# EAGLE design Calc V4 Final (EAGLE 6.3)
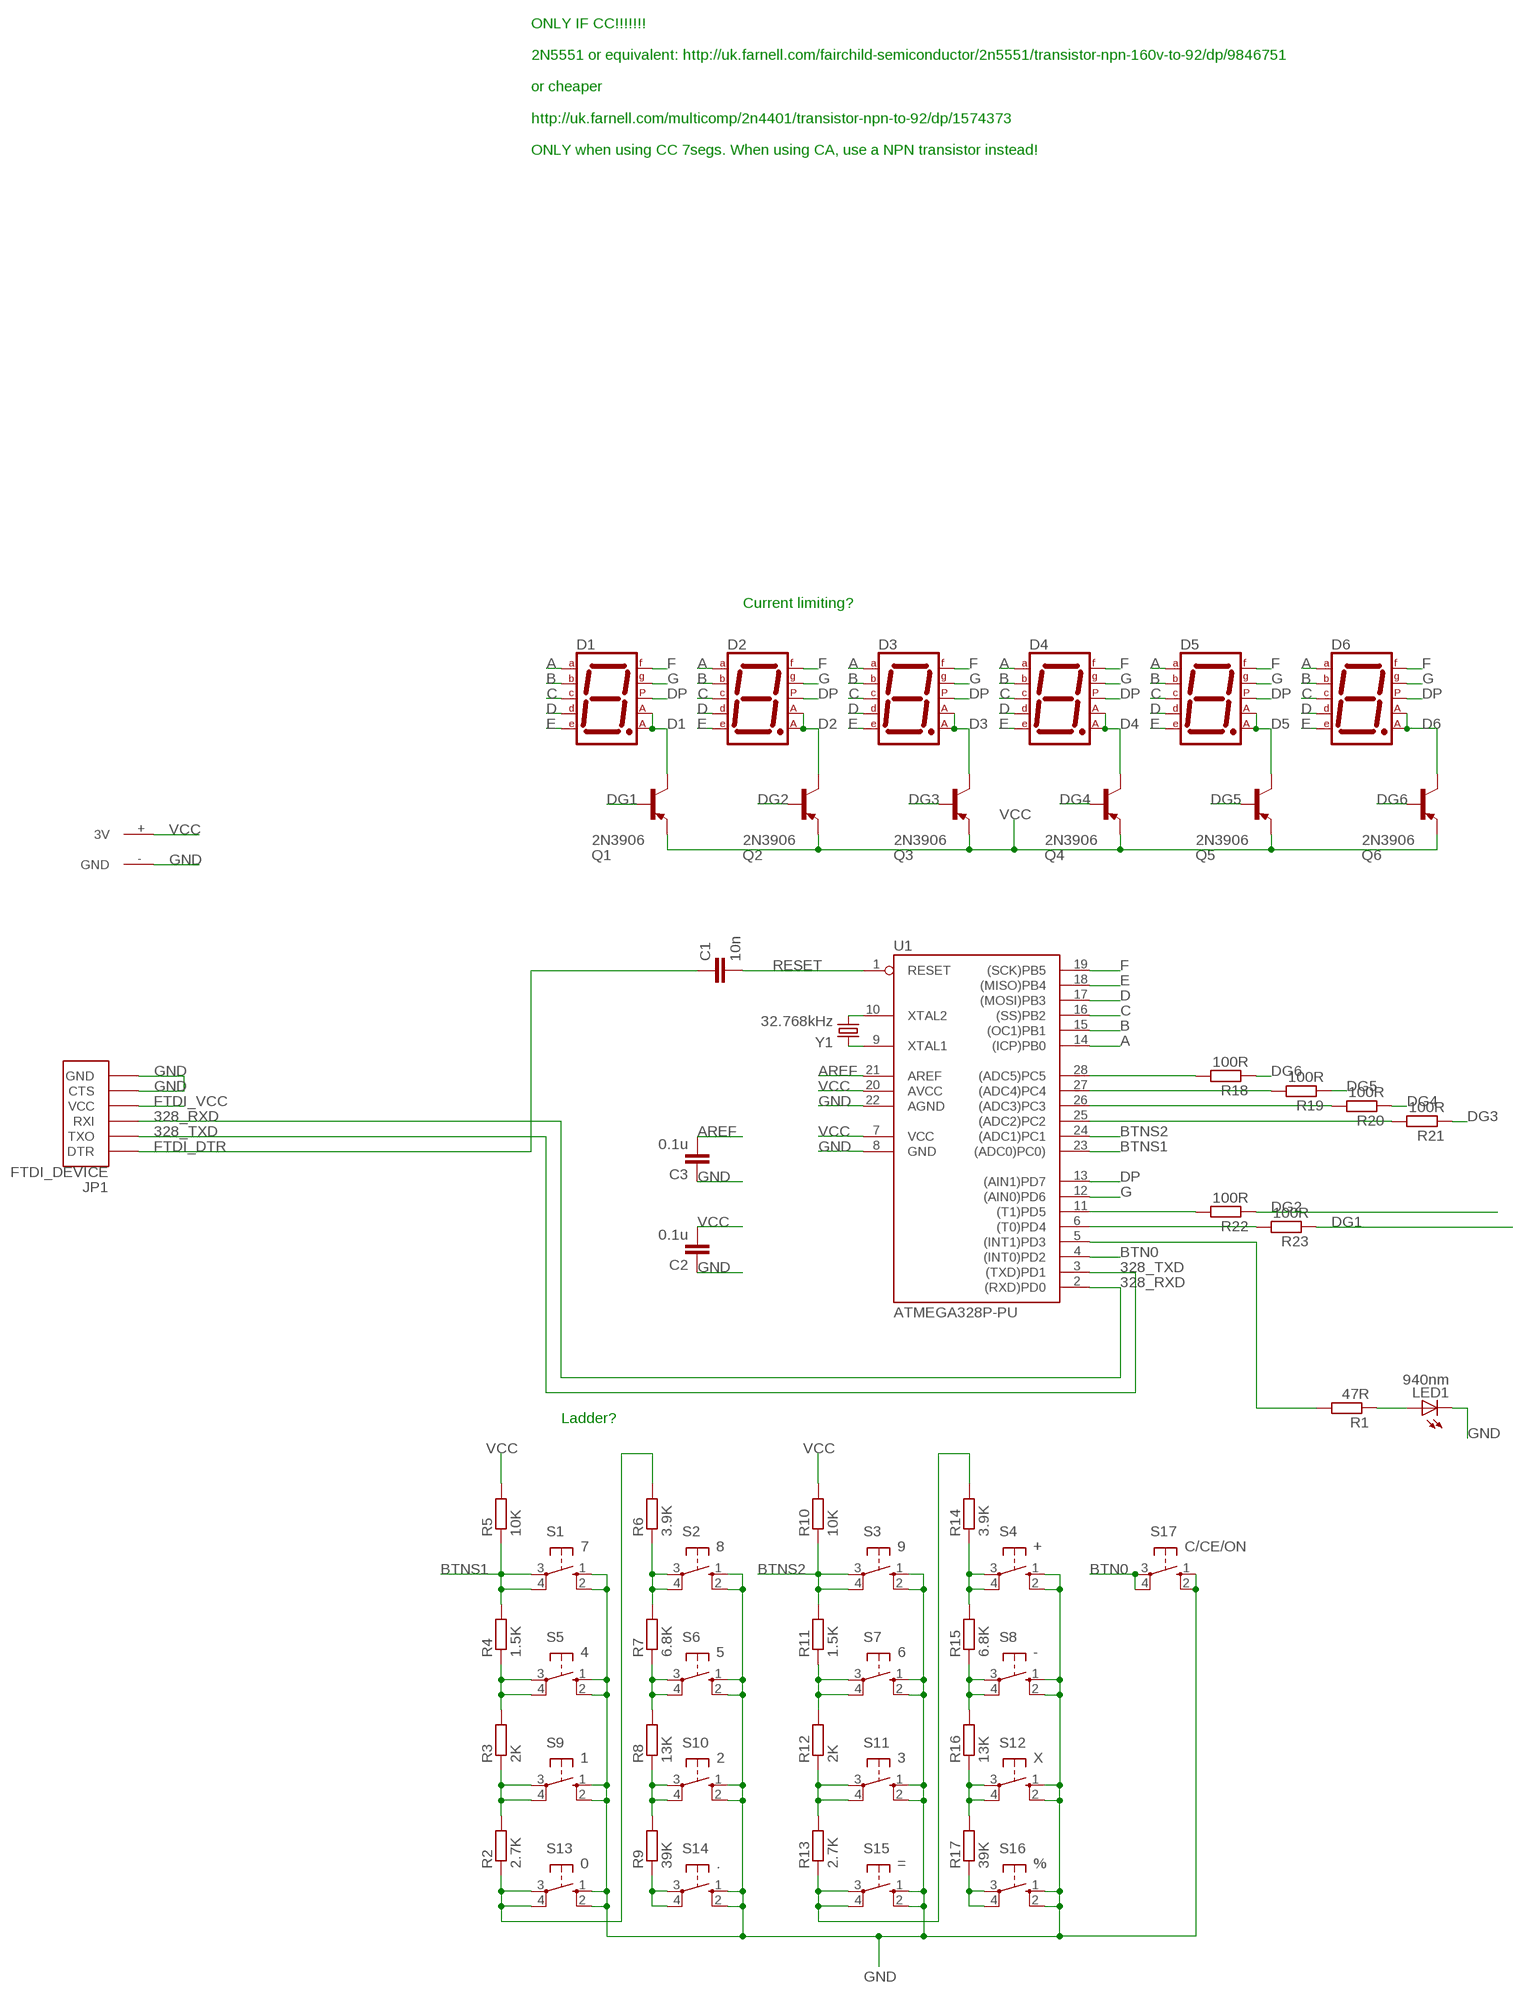
[diagram p0: schematic, sheet 1]

## Parts
C1  10n  C-EU025-024X044  [C025-024X044]
C2  0.1u  C-EU025-024X044  [C025-024X044]
C3  0.1u  C-EU025-024X044  [C025-024X044]
D1  7SEG-MCA  [7SEG-7]
D2  7SEG-MCA  [7SEG-7]
D3  7SEG-MCA  [7SEG-7]
D4  7SEG-MCA  [7SEG-7]
D5  7SEG-MCA  [7SEG-7]
D6  7SEG-MCA  [7SEG-7]
JP1  FTDI_DEVICE  [FTDI_DEVICE_SIDE]
LED1  940nm  LED5MM  [LED5MM]
Q1  2N3906  [TO92]
Q2  2N3906  [TO92]
Q3  2N3906  [TO92]
Q4  2N3906  [TO92]
Q5  2N3906  [TO92]
Q6  2N3906  [TO92]
R1  47R  R-EU_0207/10  [0207/10]
R2  2.7K  R-EU_0207/10  [0207/10]
R3  2K  R-EU_0207/10  [0207/10]
R4  1.5K  R-EU_0207/10  [0207/10]
R5  10K  R-EU_0207/10  [0207/10]
R6  3.9K  R-EU_0207/10  [0207/10]
R7  6.8K  R-EU_0207/10  [0207/10]
R8  13K  R-EU_0207/10  [0207/10]
R9  39K  R-EU_0207/10  [0207/10]
R10  10K  R-EU_0207/10  [0207/10]
R11  1.5K  R-EU_0207/10  [0207/10]
R12  2K  R-EU_0207/10  [0207/10]
R13  2.7K  R-EU_0207/10  [0207/10]
R14  3.9K  R-EU_0207/10  [0207/10]
R15  6.8K  R-EU_0207/10  [0207/10]
R16  13K  R-EU_0207/10  [0207/10]
R17  39K  R-EU_0207/10  [0207/10]
R18  100R  R-EU_0207/7  [0207/7]
R19  100R  R-EU_0207/7  [0207/7]
R20  100R  R-EU_0207/7  [0207/7]
R21  100R  R-EU_0207/7  [0207/7]
R22  100R  R-EU_0207/7  [0207/7]
R23  100R  R-EU_0207/7  [0207/7]
S1  7  10-XX  [B3F-10XX]
S2  8  10-XX  [B3F-10XX]
S3  9  10-XX  [B3F-10XX]
S4  +  10-XX  [B3F-10XX]
S5  4  10-XX  [B3F-10XX]
S6  5  10-XX  [B3F-10XX]
S7  6  10-XX  [B3F-10XX]
S8  -  10-XX  [B3F-10XX]
S9  1  10-XX  [B3F-10XX]
S10  2  10-XX  [B3F-10XX]
S11  3  10-XX  [B3F-10XX]
S12  X  10-XX  [B3F-10XX]
S13  0  10-XX  [B3F-10XX]
S14  .  10-XX  [B3F-10XX]
S15  =  10-XX  [B3F-10XX]
S16  %  10-XX  [B3F-10XX]
S17  C/CE/ON  10-XX  [B3F-10XX]
U1  ATMEGA328P-PU  [DIL28-3]
U$1  AAA-BATTERY  [AAA-BATTERY-CONTACT]
Y1  32.768kHz  CRYSTALTC26H_EZ  [TC26HEZ]

## Nets
328_RXD: JP1.P$3(RXI) U1.2((RXD)PD0)
328_TXD: JP1.P$2(TXO) U1.3((TXD)PD1)
A: D1.10(A) D2.10(A) D3.10(A) D4.10(A) D5.10(A) D6.10(A) U1.14((ICP)PB0)
AREF: C3.2 U1.21(AREF)
B: D1.9(B) D2.9(B) D3.9(B) D4.9(B) D5.9(B) D6.9(B) U1.15((OC1)PB1)
BTN0: S17.3(P) S17.4(P1) U1.4((INT0)PD2)
BTNS1: R4.2 R5.1 S1.3(P) S1.4(P1) U1.23((ADC0)PC0))
BTNS2: R10.1 R11.2 S3.3(P) S3.4(P1) U1.24((ADC1)PC1)
C: D1.8(C) D2.8(C) D3.8(C) D4.8(C) D5.8(C) D6.8(C) U1.16((SS)PB2)
D: D1.5(D) D2.5(D) D3.5(D) D4.5(D) D5.5(D) D6.5(D) U1.17((MOSI)PB3)
D1: D1.1(CA1) D1.6(CA2) Q1.1(C)
D2: D2.1(CA1) D2.6(CA2) Q2.1(C)
D3: D3.1(CA1) D3.6(CA2) Q3.1(C)
D4: D4.1(CA1) D4.6(CA2) Q4.1(C)
D5: D5.1(CA1) D5.6(CA2) Q5.1(C)
D6: D6.1(CA1) D6.6(CA2) Q6.1(C)
DG1: Q1.2(B) R23.1
DG2: Q2.2(B) R22.1
DG3: Q3.2(B) R21.1
DG4: Q4.2(B) R20.1
DG5: Q5.2(B) R19.1
DG6: Q6.2(B) R18.1
DP: D1.7(DP) D2.7(DP) D3.7(DP) D4.7(DP) D5.7(DP) D6.7(DP) U1.13((AIN1)PD7)
E: D1.4(E) D2.4(E) D3.4(E) D4.4(E) D5.4(E) D6.4(E) U1.18((MISO)PB4)
F: D1.2(F) D2.2(F) D3.2(F) D4.2(F) D5.2(F) D6.2(F) U1.19((SCK)PB5)
FTDI_DTR: C1.1 JP1.P$1(DTR)
FTDI_VCC: JP1.P$4(VCC)
G: D1.3(G) D2.3(G) D3.3(G) D4.3(G) D5.3(G) D6.3(G) U1.12((AIN0)PD6)
GND: C2.1 C3.1 JP1.P$5(CTS) JP1.P$6(GND) LED1.K(C) S1.1(S) S1.2(S1) S2.1(S) S2.2(S1) S3.1(S) S3.2(S1) S4.1(S) S4.2(S1) S5.1(S) S5.2(S1) S6.1(S) S6.2(S1) S7.1(S) S7.2(S1) S8.1(S) S8.2(S1) S9.1(S) S9.2(S1) S10.1(S) S10.2(S1) S11.1(S) S11.2(S1) S12.1(S) S12.2(S1) S13.1(S) S13.2(S1) S14.1(S) S14.2(S1) S15.1(S) S15.2(S1) S16.1(S) S16.2(S1) S17.1(S) S17.2(S1) U1.8(GND) U1.22(AGND) U$1.-(GND)
N$1: LED1.A R1.1
N$2: R1.2 U1.5((INT1)PD3)
N$4: R2.1 R6.2 S13.3(P) S13.4(P1)
N$5: R2.2 R3.1 S9.3(P) S9.4(P1)
N$6: R3.2 R4.1 S5.3(P) S5.4(P1)
N$7: R6.1 R7.2 S2.3(P) S2.4(P1)
N$9: R9.1 S14.3(P) S14.4(P1)
N$10: R8.1 R9.2 S10.3(P) S10.4(P1)
N$11: R7.1 R8.2 S6.3(P) S6.4(P1)
N$12: R18.2 U1.28((ADC5)PC5)
N$13: R11.1 R12.2 S7.3(P) S7.4(P1)
N$14: R13.1 R14.2 S15.3(P) S15.4(P1)
N$15: R12.1 R13.2 S11.3(P) S11.4(P1)
N$16: R17.1 S16.3(P) S16.4(P1)
N$17: R16.1 R17.2 S12.3(P) S12.4(P1)
N$18: R15.1 R16.2 S8.3(P) S8.4(P1)
N$19: R14.1 R15.2 S4.3(P) S4.4(P1)
N$20: R19.2 U1.27((ADC4)PC4)
N$21: R20.2 U1.26((ADC3)PC3)
N$22: R21.2 U1.25((ADC2)PC2)
N$23: R22.2 U1.11((T1)PD5)
N$24: R23.2 U1.6((T0)PD4)
RESET: C1.2 U1.1(RESET)
VCC [vcc]: C2.2 Q1.3(E) Q2.3(E) Q3.3(E) Q4.3(E) Q5.3(E) Q6.3(E) R5.2 R10.2 U1.7(VCC) U1.20(AVCC) U$1.+(3V)
XTAL_N: U1.9(XTAL1) Y1.2
XTAL_P: U1.10(XTAL2) Y1.1

## Notes on the sheet
- ONLY IF CC!!!!!!!
  
  2N5551 or equivalent: http://uk.farnell.com/fairchild-semiconductor/2n5551/transistor-npn-160v-to-92/dp/9846751
  
  or cheaper
  
  http://uk.farnell.com/multicomp/2n4401/transistor-npn-to-92/dp/1574373
  
  ONLY when using CC 7segs. When using CA, use a NPN transistor instead!
- Current limiting?
- Ladder?

## Library data of the parts
C1-C3 = rcl:C-EU: CAPACITOR, European symbol
D1-D6 = segment:7SEG-MCA: 7-segment DISPLAY single anode, 13 mm
JP1 = SparkFun-Connectors:FTDI_DEVICE: Connector which mates to FTDI basic or FTDI cable.
LED1 = ledtidy:LED: LED OSRAM: - CHIPLED LG R971, LG N971, LY N971, LG Q971, LY Q971, LO R971, LY R971 LH N974, LH R974 LS Q976, LO Q976, LY Q976 LO Q996 - Hyper CHIPLED LW Q18S LB Q993, LB Q99A, LB R99A - SideLED LS A670, LO A670, LY A670, LG A670, LP A670 LB A673, LV A673, LT A673, LW A673 LH A674 LY A675 LS A676, LA A676, LO A676, LY A676, LW A676 LS A679, LY A679, LG A679 - Hyper Micro SIDELED® LS Y876, LA Y876, LO Y876, LY Y876 LT Y87S - SmartLED LW L88C, LW L88S LB L89C, LB L89S, LG L890 LS L89K, LO L89K, LY L89K LS L896, LA L896, LO L896, LY L896 - TOPLED LS T670, LO T670, LY T670, LG T670, LP T670 LSG T670, LSP T670, LSY T670, LOP T670, LYG T670 LG T671, LOG T671, LSG T671 LB T673, LV T673, LT T673, LW T673 LH T674 LS T676, LA T676, LO T676, LY T676, LB T676, LH T676, LSB T676, LW T676 LB T67C, LV T67C, LT T67C, LS T67K, LO T67K, LY T67K, LW E67C LS E67B, LA E67B, LO E67B, LY E67B, LB E67C, LV E67C, LT E67C LW T67C LS T679, LY T679, LG T679 LS T770, LO T770, LY T770, LG T770, LP T770 LB T773, LV T773, LT T773, LW T773 LH T774 LS E675, LA E675, LY E675, LS T675 LS T776, LA T776, LO T776, LY T776, LB T776 LHGB T686 LT T68C, LB T68C - Hyper Mini TOPLED® LB M676 - Mini TOPLED Santana® LG M470 LS M47K, LO M47K, LY M47K Source: http://www.osram.convergy.de LUXEON: - LUMILED® LXK2-PW12-R00, LXK2-PW12-S00, LXK2-PW14-U00, LXK2-PW14-V00 LXK2-PM12-R00, LXK2-PM12-S00, LXK2-PM14-U00 LXK2-PE12-Q00, LXK2-PE12-R00, LXK2-PE12-S00, LXK2-PE14-T00, LXK2-PE14-U00 LXK2-PB12-K00, LXK2-PB12-L00, LXK2-PB12-M00, LXK2-PB14-N00, LXK2-PB14-P00, LXK2-PB14-Q00 LXK2-PR12-L00, LXK2-PR12-M00, LXK2-PR14-Q00, LXK2-PR14-R00 LXK2-PD12-Q00, LXK2-PD12-R00, LXK2-PD12-S00 LXK2-PH12-R00, LXK2-PH12-S00 LXK2-PL12-P00, LXK2-PL12-Q00, LXK2-PL12-R00 Source: www.luxeon.com KINGBRIGHT: KA-3528ASYC Source: www.kingbright.com
Q1-Q6 = 2n4401:2N3906: PNP Transistor
R1-R23 = largerresistor:R-EU_: RESISTOR, European symbol
S1-S17 = switch-omron:10-XX: OMRON SWITCH; MPN: B3F-1000; OC_FARNELL: 176432; OC_NEWARK: 36M3542
U1 = SmartPrj:ATMEGA328P-: MICROCONTROLLER 4 Kbytes FLASH 128 bytes SRAM 256 bytes EEPROM UART 6-channel 10 bit ADC
U$1 = batcontact:AAA-BATTERY
Y1 = SparkFun-FreqCtrl:CRYSTAL: Various standard crystals. Proven footprints. Spark Fun Electronics SKU : COM-00534

## Net classes
1 vcc: width 0.406 mm

## Board
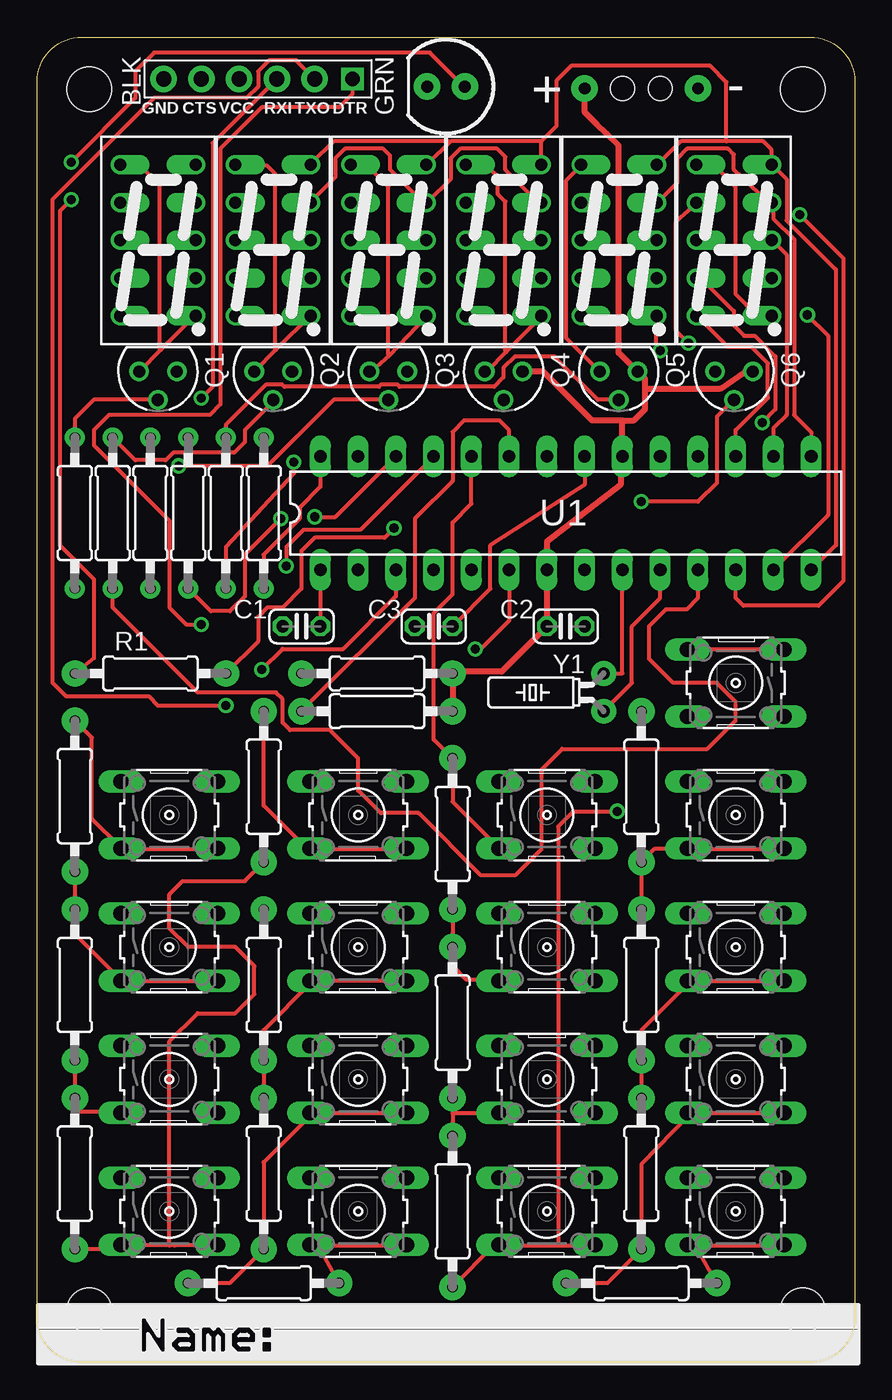
[diagram p1: board, top side]
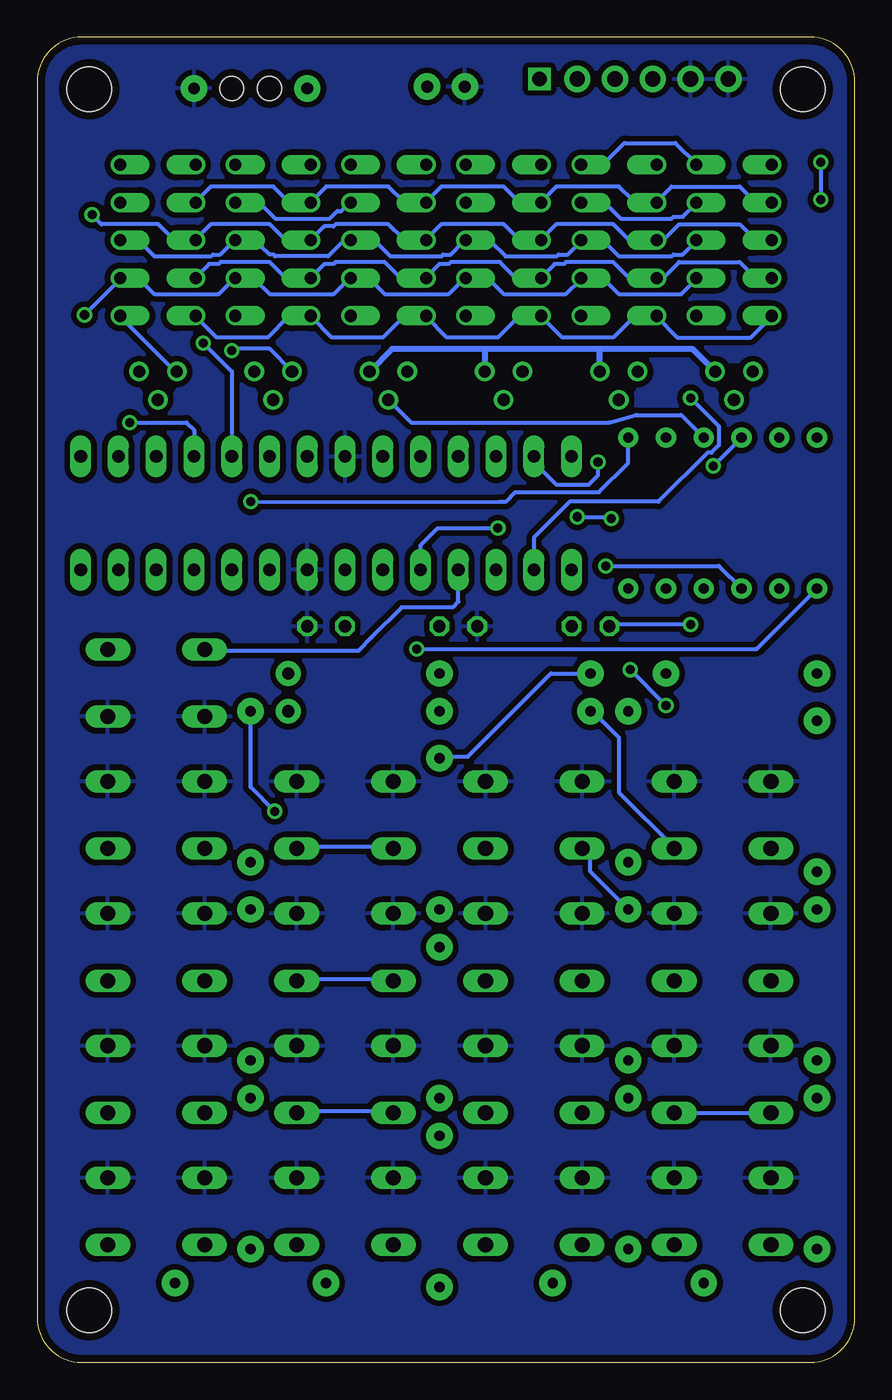
[diagram p2: board, bottom side, seen from below]

Size 55 x 89.17 mm. Coordinates in mm from the lower left corner, seen from the top.
Outline: 55,86.17 55,3 arc-90 52,0 3,0 arc-90 0,3 0,86.17 arc-90 3,89.17 52,89.17 arc-90 55,86.17
Copper layers (1*16): Top 0.035mm / dielectric 1.5mm / Bottom 0.035mm
Design rules "default *": minimum track width 10mil, minimum drill 24mil, track to track 8mil, track to pad 8mil, pad to pad 8mil, via to via 8mil, smd to smd 8mil, copper to edge 20mil, drill to drill 8mil, minimum pad ring 10mil, minimum via ring 8mil, stop-mask expansion 2mil, vias tented up to drill 0.7mm, thermal gap 15mil
Holes 3 mm at 3.5,85.67 51.5,85.67 3.5,3.5 51.5,3.5
bRestrict: area 6.9,64.8 to 9.4,66.7; area 14.6,64.8 to 17.1,66.7; area 22.4,64.8 to 24.9,66.7; area 30.1,64.8 to 32.6,66.7; area 37.8,64.8 to 40.4,66.7; area 45.6,64.8 to 48.1,66.7

### Footprints (pad centres in the part's own frame; a part is rotated, then mirrored left to right if it is on the bottom)
C025-024X044 = drill 0.813 octagon: 1 -1.27,0; 2 1.27,0
7SEG-7 = drill 0.813 offset: 1 -2.54,5.08; 2 -2.54,2.54; 3 -2.54,0; 4 -2.54,-2.54; 5 -2.54,-5.08; 6 2.54,-5.08; 7 2.54,-2.54; 8 2.54,0; 9 2.54,2.54; 10 2.54,5.08
FTDI_DEVICE_SIDE = drill 1 square: P$1 -6.35,0 | drill 1.016 pad 1.778: P$2 -3.81,0; P$3 -1.27,0; P$4 1.27,0; P$5 3.81,0; P$6 6.35,0
LED5MM = drill 0.813 pad 1.778: A -1.27,0; K 1.27,0
TO92 = drill 0.813: 1 1.27,0; 2 0,1.905; 3 -1.27,0
0207/10 = drill 0.7 pad 1.778: 1 -5.08,0; 2 5.08,0
0207/7 = drill 0.7 pad 1.35: 1 -5.08,0; 2 5.08,0
B3F-10XX = drill 1.016 long: 1 -3.251,2.261; 2 3.251,2.261; 3 -3.251,-2.261; 4 3.251,-2.261
DIL28-3 = drill 0.85 pad 1.422 long: 1 -16.51,-3.81; 2 -13.97,-3.81; 3 -11.43,-3.81; 4 -8.89,-3.81; 5 -6.35,-3.81; 6 -3.81,-3.81; 7 -1.27,-3.81; 8 1.27,-3.81; 9 3.81,-3.81; 10 6.35,-3.81; 11 8.89,-3.81; 12 11.43,-3.81; 13 13.97,-3.81; 14 16.51,-3.81; 15 16.51,3.81; 16 13.97,3.81; 17 11.43,3.81; 18 8.89,3.81; 19 6.35,3.81; 20 3.81,3.81; 21 1.27,3.81; 22 -1.27,3.81; 23 -3.81,3.81; 24 -6.35,3.81; 25 -8.89,3.81; 26 -11.43,3.81; 27 -13.97,3.81; 28 -16.51,3.81
AAA-BATTERY-CONTACT = drill 0.8 pad 1.778: + -3.81,0; - 3.81,0 | hole 1.6: -1.27,0; 1.27,0
TC26HEZ = drill 0.813 pad 1.676: 1 -1.27,0; 2 1.27,0

### Placement (x,y rotation side)
C1  17.78,49.53 0 top
C2  35.56,49.53 180 top
C3  26.67,49.53 0 top
D1  8.12,75.5 0 top
D2  15.88,75.5 0 top
D3  23.62,75.5 0 top
D4  31.38,75.5 0 top
D5  39.12,75.5 0 top
D6  46.88,75.5 0 top
JP1  14.86,86.36 180 top
LED1  27.5,85.85 180 top
Q1  8.12,66.67 180 top
Q2  15.88,66.67 180 top
Q3  23.62,66.67 180 top
Q4  31.38,66.67 180 top
Q5  39.12,66.67 180 top
Q6  46.88,66.67 180 top
R1  7.62,46.35 0 top
R2  2.54,12.7 90 top
R3  2.54,25.4 90 top
R4  2.54,38.1 90 top
R5  22.86,43.81 0 top
R6  15.24,38.73 270 top
R7  15.24,25.4 90 top
R8  15.24,12.7 90 top
R9  15.24,5.33 180 top
R10  22.86,46.35 0 top
R11  27.94,35.56 90 top
R12  27.94,22.86 90 top
R13  27.94,10.16 90 top
R14  40.64,38.73 90 top
R15  40.64,25.4 90 top
R16  40.64,12.7 90 top
R17  40.64,5.33 180 top
R18  15.24,57.15 270 top
R19  12.7,57.15 270 top
R20  10.16,57.15 270 top
R21  7.62,57.15 270 top
R22  5.08,57.15 270 top
R23  2.54,57.15 270 top
S1  8.89,36.83 0 top
S2  21.59,36.83 0 top
S3  34.29,36.83 0 top
S4  46.99,36.83 0 top
S5  8.89,27.94 0 top
S6  21.59,27.94 0 top
S7  34.29,27.94 0 top
S8  46.99,27.94 0 top
S9  8.89,19.05 0 top
S10  21.59,19.05 0 top
S11  34.29,19.05 0 top
S12  46.99,19.05 0 top
S13  8.89,10.16 0 top
S14  21.59,10.16 0 top
S15  34.29,10.16 0 top
S16  46.99,10.16 0 top
S17  46.99,45.72 180 top
U1  35.56,57.15 0 top
U$1  40.64,85.72 0 top
Y1  38.1,45.09 90 top

### Tracks (layer width: path | path; a pad name or v marks a point on that pad's centre or on a via)
328_RXD  (via drill 0.61)
  Top 0.254: v11.05,64.9 11.81,65.66 11.81,82.04 JP1.P$3
  Bottom 0.254: U1.2 21.59,55.5 19.18,57.91 13.21,57.91 9.91,61.21 9.65,61.21 9.14,61.72 9.14,62.99 v11.05,64.9
328_TXD  (via drill 0.61)
  Top 0.254: U1.3 24.13,51.56 20.57,48.01 16.51,48.01 v15.11,46.61 | v12.7,44.2 8.13,44.2 7.49,44.83 1.93,44.83 1.02,45.74 1.02,78.23 7.87,85.09 14.1,85.09 14.86,85.85 14.86,86.87 15.62,87.63 17.4,87.63 JP1.P$2
  Bottom 0.254: v12.7,44.2 v15.11,46.61
A
  Top 0.254: 27.75,82.11 27.81,82.17 33.91,82.17 | 27.75,82.11 26.29,80.64 D3.10 | 33.91,82.17 33.91,80.64 D4.10 | D2.10 18.41,80.64 19.94,82.17 27.69,82.17 27.75,82.11 | 46.35,82.17 48.84,82.17 49.4,81.6 49.4,80.64 D6.10 49.53,80.52 50.42,79.63 50.42,76.83 53.72,73.53 53.72,54.99 U1.14 | 46.35,82.17 43.31,82.17 41.78,80.64 D5.10 | 33.91,82.17 34.92,83.19 34.92,86.23 35.94,87.25 45.26,87.25 46.35,86.16 46.35,82.17
  Bottom 0.254: D1.10 10.67,80.64 12.06,82.04 15.49,82.04 16.89,80.64 18.41,80.64 D2.10
AREF
  Top 0.254: C3.2 30.48,52.07 30.48,54.99 36.83,59.05 U1.21
B
  Top 0.254: D4.9 33.91,78.11 33.66,78.11 31.5,80.26 31.5,81.12 30.96,81.66 28.45,81.66 27.81,81.03 27.81,79.63 26.29,78.11 D3.9 26.16,78.11 25.91,78.11 23.75,80.26 23.75,81.2 23.29,81.66 20.7,81.66 20.07,81.03 20.07,79.76 18.41,78.11 D2.9 | D5.9 41.78,78.11 43.05,79.38 43.05,81 43.71,81.66 46.48,81.66 46.86,81.28 46.86,80.26 49.15,78.11 49.4,78.11 D6.9 49.53,77.98 49.53,76.96 50.93,75.56 50.93,63.75 52.07,62.61 U1.15
  Bottom 0.254: D1.9 10.67,77.98 11.56,77.09 12.19,77.09 12.32,76.96 15.75,76.96 16.76,77.98 18.41,77.98 D2.9 | D4.9 34.04,77.98 34.54,77.47 34.8,77.47 35.31,76.96 38.99,76.96 40.01,77.98 41.66,77.98 D5.9
BTN0
  Top 0.254: S17.3 50.16,48.01 43.81,48.01 S17.4
  Bottom 0.254: U1.4 26.67,51.18 27.05,50.8 30.48,50.8 32.51,48.77 33.4,47.88 44.2,47.88 42.8,48.01 43.69,48.01 S17.4
BTNS1
  Top 0.254: R4.2 3.68,42.04 3.68,36.58 5.59,34.67 S1.3 5.71,34.54 12.06,34.54 S1.4 | R5.1 25.4,51.44 25.4,56.77 27.94,59.31 27.94,62.61 28.7,63.37 31.1,63.37 31.75,62.73 U1.23
  Bottom 0.254: R5.1 17.65,43.81 15.88,42.04 15.88,38.35 12.19,34.67 S1.4
BTNS2
  Top 0.254: U1.24 29.21,57.78 27.94,56.52 27.94,51.69 26.67,50.42 26.67,41.91 R11.2 27.94,37.72 30.99,34.67 S3.3
  Bottom 0.254: R10.1 20.45,46.35 26.04,40.77 27.81,40.77 R11.2 | S3.4 37.47,34.67 31.11,34.67 S3.3
C
  Top 0.254: U1.16 49.53,62.87 50.42,63.75 50.42,74.55 49.53,75.44 D6.8
  Bottom 0.254: D6.8 49.4,75.44 48.13,75.44 47.12,74.42 43.31,74.42 43.18,74.55 42.67,74.55 41.78,75.44 D5.8 41.66,75.44 41.27,75.06 39.88,75.06 39.37,74.55 39.12,74.55 38.99,74.42 35.43,74.42 34.42,75.44 34.04,75.44 D4.8 33.91,75.44 32.26,75.44 31.24,74.42 27.81,74.42 27.69,74.55 27.18,74.55 26.29,75.44 D3.8 26.16,75.44 24.51,75.44 23.5,74.42 20.07,74.42 19.94,74.55 19.3,74.55 18.41,75.44 | 18.41,75.44 16.89,75.44 15.88,74.42 12.32,74.42 12.19,74.55 11.56,74.55 10.67,75.44 D1.8 | 18.41,75.44 D2.8
D
  Top 0.254: U1.17 46.99,62.74 49.15,64.9 49.15,67.23 48.06,68.33 46.48,68.33 44.45,70.36 D6.5
  Bottom 0.254: D1.5 5.59,70.36 6.99,68.96 11.94,68.96 13.34,70.36 D2.5 13.34,70.23 14.99,70.23 16.26,68.96 19.68,68.96 21.08,70.36 D3.5 21.21,70.36 22.61,70.36 24,68.96 27.43,68.96 28.83,70.36 D4.5 28.96,70.36 30.35,70.36 31.75,68.96 35.18,68.96 36.58,70.36 D5.5 36.7,70.36 38.1,70.36 39.5,68.96 42.93,68.96 44.32,70.36 D6.5
D1
  Top 0.254: 8.32,68.14 10.54,70.36 D1.6 | 8.32,68.14 Q1.1 | D1.1 5.59,80.52 6.95,80.52 8.26,79.21 8.26,68.2 8.32,68.14
D2
  Top 0.254: 16.07,68.14 18.41,70.48 D2.6 | 16.07,68.14 Q2.1 | D2.1 13.34,80.52 15.48,80.52 16,79.99 16,68.2 16.07,68.14
D3
  Top 0.254: 23.69,67.75 26.16,70.36 D3.6 | 23.69,67.75 22.48,66.67 Q3.1 | D3.1 21.21,80.52 22.22,80.52 23.62,79.11 23.62,67.82 23.69,67.75
D4
  Top 0.254: 31.56,68.01 33.91,70.36 D4.6 | 31.56,68.01 30.23,66.67 Q4.1 | D4.1 28.96,80.52 30.27,80.52 30.99,79.8 30.99,78.61 31.5,78.11 31.5,68.07 31.56,68.01
D5  (via drill 0.61)
  Top 0.254: Q5.1 35.56,68.96 35.56,79.5 36.58,80.52 D5.1 | v41.91,68.07 41.91,68.33 41.66,68.58 41.66,70.36 D5.6
  Bottom 0.254: v41.91,68.07 41.66,68.2 39.37,68.2 Q5.1
D6
  Top 0.254: D6.1 44.45,80.52 45.57,80.52 46.99,79.09 46.99,71.88 48.39,70.48 49.4,70.48 D6.6
  Bottom 0.254: Q6.1 45.72,66.67 49.4,70.36 D6.6
DG1
  Top 0.254: R23.1 2.54,63.5 3.81,64.77 Q1.2
DG2
  Top 0.254: R22.1 6.6,60.71 8.64,60.71 9.14,61.21 13.26,61.21 13.97,61.93 13.97,62.74 15.88,64.64 Q2.2
DG3  (via drill 0.61)
  Top 0.254: v9.53,60.33 15.49,60.33 19.94,64.77 Q3.2
  Bottom 0.254: v9.53,60.33 R21.1
DG4
  Bottom 0.254: R20.1 11.68,63.75 14.73,63.75 16.51,63.25 29.84,63.25 Q4.2
DG5
  Top 0.254: Q5.2 37.72,64.77 34.8,67.69 32.13,67.69 31.37,66.93 31.37,66.29 30.73,65.66 24.38,65.66 24.26,65.79 23.11,65.79 22.99,65.66 16.64,65.66 16.51,65.79 15.37,65.79 12.7,63.12 R19.1
DG6  (via drill 0.61)
  Top 0.254: v40.64,57.91 44.45,57.91 45.72,59.18 45.72,63.63 46.86,64.77 Q6.2
  Bottom 0.254: R18.1 15.24,60.52 17.21,58.55 22.86,58.55 22.86,58.54 23.5,57.91 23.88,57.91 v40.64,57.91
DP  (via drill 0.61)
  Top 0.254: U1.13 53.21,57.02 53.21,69.09 v51.82,70.48
  Bottom 0.254: 18.41,72.9 16.89,72.9 15.88,71.88 11.68,71.88 10.67,72.9 D1.7 | 18.41,72.9 19.43,71.88 23.62,71.88 24.64,72.9 26.16,72.9 D3.7 26.29,72.9 27.3,71.88 31.62,71.88 32.64,72.9 33.91,72.9 D4.7 34.04,72.9 35.05,71.88 39.37,71.88 40.39,72.9 41.66,72.9 D5.7 41.78,72.9 42.8,71.88 47.12,71.88 48.13,72.9 49.4,72.9 D6.7 49.4,72.77 49.53,72.77 v51.82,70.48 | 18.41,72.9 D2.7
E  (via drill 0.61)
  Top 0.254: v48.77,63.25 49.66,64.14 49.66,67.69 48.26,69.09 47.56,69.09 46.86,69.78 46.86,70.74 44.7,72.9 44.45,72.9 D6.4
  Bottom 0.254: 13.34,73.03 12.83,73.03 11.81,74.04 7.75,74.04 6.73,73.03 5.59,73.03 D1.4 | 13.34,73.03 15.24,73.03 16.26,74.04 19.43,74.04 19.56,73.91 20.19,73.91 21.08,73.03 D3.4 21.21,73.03 22.86,73.03 23.88,74.04 27.18,74.04 27.3,73.91 27.94,73.91 28.83,73.03 D4.4 28.96,73.03 30.61,73.03 31.62,74.04 34.92,74.04 35.05,73.91 35.69,73.91 36.58,73.03 D5.4 36.7,73.03 38.35,73.03 39.37,74.04 42.67,74.04 42.8,73.91 43.43,73.91 44.32,73.03 D6.4 | 13.34,73.03 D2.4 | U1.18 44.45,62.74 44.96,63.25 v48.77,63.25
F  (via drill 0.61)
  Top 0.254: v43.81,68.58 42.93,69.47 42.93,76.71 44.32,77.98 D6.2
  Bottom 0.254: D1.2 5.59,78.11 5.97,78.49 7.11,78.49 7.75,79.12 12.32,79.12 13.34,78.11 D2.2 13.34,78.23 14.99,78.23 15.88,79.12 20.07,79.12 21.08,78.11 D3.2 21.21,78.11 22.61,78.11 23.62,79.12 27.81,79.12 28.83,78.11 D4.2 28.96,78.11 30.35,78.11 31.37,79.12 35.56,79.12 36.58,78.11 D5.2 36.7,78.11 38.1,78.11 39.12,79.12 43.31,79.12 44.32,78.11 D6.2 | v43.81,68.58 41.91,66.67 U1.19
FTDI_DTR  (via drill 0.61)
  Top 0.254: 11.08,49.66 v11.05,49.66 10.03,49.66 8.89,50.8 8.89,56.64 3.81,61.72 3.81,62.74 4.83,63.75 11.6,63.75 12.32,64.47 12.32,81.66 15.11,84.45 20.32,84.45 21.21,85.34 JP1.P$1
  Bottom 0.254: C1.1 16.38,49.66 v11.05,49.66
G  (via drill 0.61)
  Top 0.254: U1.12 46.99,51.44 47.5,50.93 52.57,50.93 54.23,52.59 54.23,74.3 v51.31,77.22
  Bottom 0.254: 13.34,75.56 12.83,75.56 11.81,76.58 7.75,76.58 7.11,75.95 5.97,75.95 5.59,75.56 D1.3 | 13.34,75.56 15.24,75.56 16.26,76.58 20.07,76.58 21.08,75.56 D3.3 21.21,75.56 22.61,75.56 23.62,76.58 27.81,76.58 28.83,75.56 D4.3 28.96,75.56 30.35,75.56 31.37,76.58 34.92,76.58 35.05,76.45 35.69,76.45 36.58,75.56 D5.3 36.7,75.56 38.35,75.56 39.37,76.58 43.31,76.58 44.32,75.56 D6.3 44.45,75.56 45.85,75.56 46.86,76.58 50.67,76.58 v51.31,77.22 | 13.34,75.56 D2.3
GND
  pour Bottom (isolate 0.375, rank 5): -11.43,93.34 62.23,93.34 62.23,-7.62 -11.43,-7.62
N$1  (via drill 0.61)
  Top 0.254: R1.1 3.81,47.37 3.81,52.7 1.52,54.99 1.52,77.47 v2.29,78.23 | v2.29,80.77 6.6,85.09 6.6,86.87 7.87,88.14 26.42,88.14 28.7,85.85 LED1.A
  Bottom 0.254: v2.29,80.77 v2.29,78.23
N$2  (via drill 0.61)
  Top 0.254: R1.2 14.86,48.51 14.86,50.16 15.49,50.8 16.51,50.8 17.78,52.07 17.78,54.61 18.67,55.5 23.37,55.5 v24,56.13
  Bottom 0.254: v24,56.13 28.07,56.13 29.21,54.99 U1.5
N$4
  Top 0.254: R2.1 5.59,7.62 5.59,7.87 S13.3 5.71,7.87 8.89,7.87 | 9.25,7.87 12.06,7.87 S13.4 9.25,7.87 | 9.25,7.87 8.89,7.87 | 8.89,7.87 8.89,21.59 10.79,23.5 13.34,23.5 14.61,24.77 14.61,26.67 13.34,27.94 10.16,27.94 8.89,29.21 8.89,31.49 9.79,32.38 13.97,32.38 R6.2
N$5
  Top 0.254: R3.1 R2.2 2.54,16.89 5.59,16.89 S9.3
  Bottom 0.254: S9.4 12.12,16.76 5.71,16.76 S9.3
N$6
  Top 0.254: R4.1 R3.2 2.54,28.83 5.59,25.78 S5.3 5.71,25.65 12.06,25.65 S5.4
N$7
  Top 0.254: S2.4 24.77,34.54 18.41,34.54 S2.3 18.14,34.57 15.24,37.47 R6.1
  Bottom 0.254: R7.2 17.78,33.02 17.78,34.01 S2.3
N$9
  Top 0.254: R9.1 19.05,7.62 18.41,7.87 S14.3 18.54,7.87 24.77,7.87 S14.4
N$10
  Top 0.254: R9.2 12.95,5.33 R8.1 15.24,13.46 18.41,16.64 S10.3 18.41,16.76 24.77,16.76 S10.4
N$11
  Top 0.254: R8.2 R7.1 15.24,22.35 18.41,25.53 S6.3 18.41,25.65 24.77,25.65 S6.4
N$12
  Top 0.254: R18.2 15.24,54.36 17.65,56.77 17.65,57.53 19.05,58.93 U1.28
N$13
  Top 0.254: R11.1 27.94,28.83 R12.2 27.94,26.67 28.83,25.78 30.99,25.78 S7.3
  Bottom 0.254: S7.4 37.47,25.78 31.11,25.78 S7.3
N$14  (via drill 0.61)
  Top 0.254: v39.01,37.08 36.08,37.08 35.05,36.06 35.05,7.87 | 35.05,7.87 31.11,7.87 S15.3 30.76,7.9 R13.1 | 35.05,7.87 37.47,7.87 S15.4
  Bottom 0.254: v39.01,37.08 40.64,38.71 R14.2
N$15
  Top 0.254: R12.1 27.94,16.76 | 27.94,16.76 R13.2 | 27.94,16.76 30.99,16.76 S11.3
  Bottom 0.254: S11.4 37.47,16.89 31.11,16.89 S11.3
N$16
  Top 0.254: R17.1 44.32,7.75 43.81,7.87 S16.3 43.94,7.87 50.16,7.87 S16.4
N$17
  Top 0.254: R17.2 38.35,5.33 R16.1 40.64,13.34 43.81,16.64 S12.3 43.81,16.76 50.16,16.76 S12.4
N$18
  Top 0.254: S8.4 50.16,25.65 43.81,25.65 S8.3 43.81,25.53 40.64,22.35 R15.1 R16.2
N$19
  Top 0.254: 43.69,34.54 S4.3 | S4.3 41.55,34.57 R14.1 R15.2 | S4.4 50.16,34.54 43.81,34.54 S4.3
N$20  (via drill 0.61)
  Top 0.254: R19.2 12.7,54.86 17.27,59.82 v17.27,60.58
  Bottom 0.254: U1.27 21.59,60.58 20.07,59.05 17.91,59.05 17.27,59.69 v17.27,60.58
N$21  (via drill 0.61)
  Top 0.254: R20.2 11.68,50.55 12.97,50.55 13.97,51.55 13.97,54.36 v16.38,56.77 | v18.67,56.9 20.07,56.9 U1.26
  Bottom 0.254: v18.67,56.9 16.51,56.9 v16.38,56.77
N$22  (via drill 0.61)
  Top 0.254: v16.76,53.59 16.76,54.86 17.91,56.01 21.72,56.01 U1.25
  Bottom 0.254: R21.2 9.14,53.59 v16.76,53.59
N$23
  Top 0.254: R22.2 5.08,50.8 10.79,45.09 16.05,45.09 16.51,44.63 16.51,43.05 17.02,42.55 19.68,42.55 21.59,40.64 21.59,38.48 23.11,36.96 25.65,36.96 29.84,32.77 32.15,32.77 33.91,34.53 33.91,39.88 35.31,41.27 45.09,41.27 46.99,43.18 46.99,44.45 45.72,45.72 42.8,45.72 41.15,47.37 41.15,49.52 42.3,50.67 43.69,50.67 44.45,51.44 U1.11
N$24  (via drill 0.61)
  Top 0.254: v29.46,48.01 29.84,48.01 31.75,49.91 U1.6
  Bottom 0.254: R23.2 6.6,48.01 v29.46,48.01
RESET
  Top 0.254: U1.1 C1.2
VCC
  Top 0.406: R5.2 R10.2 28.07,46.48 31.24,46.48 C2.2 U1.7 34.29,55.24 39.24,59.05 39.24,60.83 U1.20 39.37,63.37 | 39.37,63.37 37.34,63.37 34.04,66.67 Q4.3 | 40.89,65.53 40.89,66.17 40.39,66.67 Q5.3 40.26,66.8 39.12,67.94 39.12,81.89 38.33,82.68 37.64,83.31 36.83,84.12 U$1.+ | 39.37,63.37 40.13,63.37 40.89,64.14 40.89,65.53 | Q6.3 47.62,66.67 45.97,65.53 40.89,65.53
  Bottom 0.406: 17.14,68.2 10.92,68.2 Q1.3 | Q2.3 17.14,68.2 | 24.89,67.06 Q3.3 24.89,67.06 | 24.89,68.2 17.14,68.2 | 24.89,68.2 24.89,67.06 | 24.89,68.2 31.11,68.2 Q4.3
XTAL_N
  Top 0.254: Y1.2 39.37,46.35 U1.9
XTAL_P
  Top 0.254: Y1.1 40.01,45.72 40.01,49.53 41.91,51.44 U1.10

### Text on the board
Document: Bigger pads? / Swap C3, C2 / IR detector to read remotes / Battery Box change / 3D PRint casing / No top soldermask? / Fix that one drill hole on base resistor#6 / Nicer SS for the switch?